# Altium schematic sheet Programmer.SchDoc: Programmer
size A3; Organization: Use Organization_Name in ProjParam; Address1: Eliot Ferragni; Address2: STI-MOBOTS; Address3: EPFL; Address4: CH-1015 LAUSANNE; DocumentNumber: 9; Revision: A; SheetNumber: 3; SheetTotal: 11; ApprovedBy: Init ApprovedBy in DocParam; CheckedBy: Init CheckedBy in DocParam; Author: Init Author in DocParam; CompanyName: Init CompanyName in DocParam; DrawnBy: Init DrawBy in DocParam; Engineer: Init Engineer in DocParam; Title2: BlackMagic prog + 4 BLDC controller + pwr ctrl; DocumentName: Init DocumentName in DocParam; ProjectName: Init ProjectName in DocParam
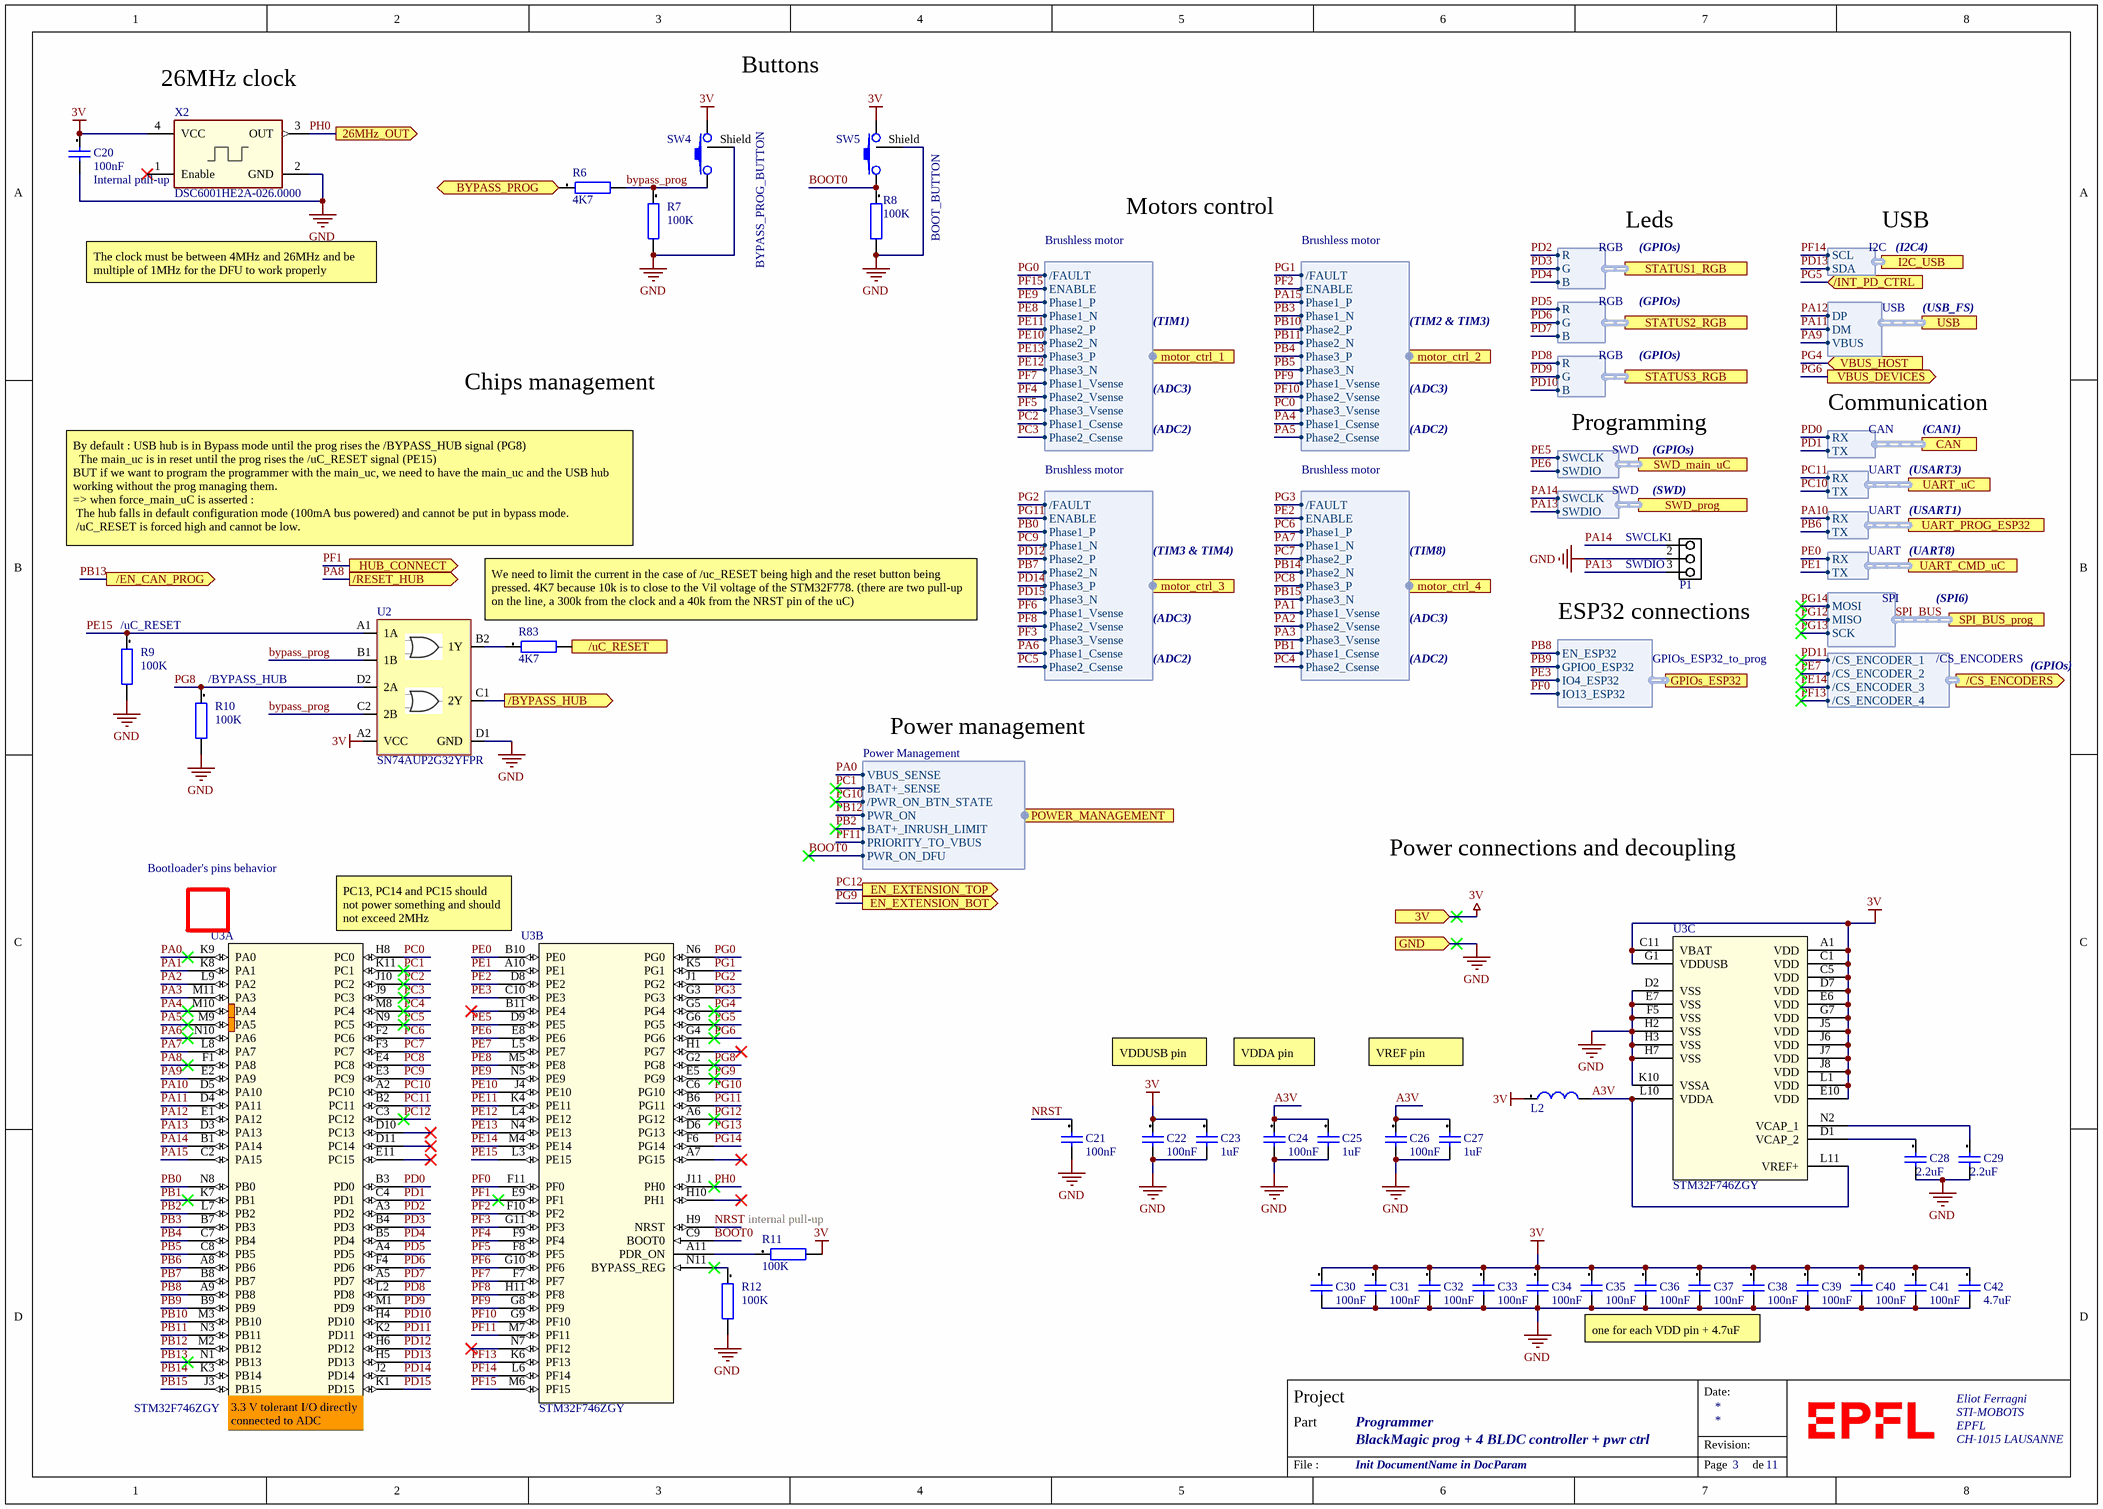
[diagram p0: Programmer.SchDoc]

## Parts
C20  100nF  [CAPC0201(0603)33_L]
C21  100nF  [CAPC0201(0603)33_L]
C22  100nF  [CAPC0201(0603)33_L]
C23  1uF  [CAPC0201(0603)33_L]
C24  100nF  [CAPC0201(0603)33_L]
C25  1uF  [CAPC0201(0603)33_L]
C26  100nF  [CAPC0201(0603)33_L]
C27  1uF  [CAPC0201(0603)33_L]
C28  2.2uF  [CAPC0201(0603)33_L]
C29  2.2uF  [CAPC0201(0603)33_L]
C30  100nF  [CAPC0201(0603)33_L]
C31  100nF  [CAPC0201(0603)33_L]
C32  100nF  [CAPC0201(0603)33_L]
C33  100nF  [CAPC0201(0603)33_L]
C34  100nF  [CAPC0201(0603)33_L]
C35  100nF  [CAPC0201(0603)33_L]
C36  100nF  [CAPC0201(0603)33_L]
C37  100nF  [CAPC0201(0603)33_L]
C38  100nF  [CAPC0201(0603)33_L]
C39  100nF  [CAPC0201(0603)33_L]
C40  100nF  [CAPC0201(0603)33_L]
C41  100nF  [CAPC0201(0603)33_L]
C42  4.7uF  [CAPC0201(0603)33_L]
L2  MMZ1005S601HT000  [0402 inductor]  (value not drawn)
P1  SWD_PADS_3pin  [SWD_pads_3pin]  (value not drawn)  (no BOM)
R6  4K7  [RESC0201(0603)_L]
R7  100K  [RESC0201(0603)_L]
R8  100K  [RESC0201(0603)_L]
R9  100K  [RESC0201(0603)_L]
R10  100K  [RESC0201(0603)_L]
R11  100K  [RESC0201(0603)_L]
R12  100K  [RESC0201(0603)_L]
R83  4K7  [RESC0201(0603)_L]
SW4  button  [C&K_KMR2]  (value not drawn)
SW5  button  [C&K_KMR2]  (value not drawn)
U2  SN74AUP2G32YFPR  [DSBGA 8-pin Ti]
U3  STM32F746ZGY  [WLCSP-143]  (parts A,B,C of 3)
X2  DSC6001HE2A-026.0000  [Oscillator 1.6x1.2mm VFLGA]

## Ports
3V (in), 26MHz_OUT (out), /BYPASS_HUB (out), /CS_ENCODERS (out, harness /CS_ENCODERS), /EN_CAN_PROG (out), /INT_PD_CTRL (in), /RESET_HUB (out), /uC_RESET (out), BYPASS_PROG (bidir), CAN (harness CAN), EN_EXTENSION_BOT (out), EN_EXTENSION_TOP (out), GND (in), GPIOs_ESP32 (harness GPIOs_ESP32_to_prog), HUB_CONNECT (out), I2C_USB (harness I2C), motor_ctrl_1 (harness Brushless motor), motor_ctrl_2 (harness Brushless motor), motor_ctrl_3 (harness Brushless motor), motor_ctrl_4 (harness Brushless motor), POWER_MANAGEMENT (harness Power Management), SPI_BUS_prog (harness SPI), STATUS1_RGB (harness RGB), STATUS2_RGB (harness RGB), STATUS3_RGB (harness RGB), SWD_main_uC (harness SWD), SWD_prog (harness SWD), UART_CMD_uC (harness UART), UART_PROG_ESP32 (harness UART), UART_uC (harness UART), USB (harness USB), VBUS_DEVICES (out), VBUS_HOST (in)

## Harnesses
CAN: TX, RX
USB: DM, DP, VBUS
UART: RX, TX
SWD: SWDIO, SWCLK
RGB: R, G, B
I2C: SDA, SCL
SPI: MISO, MOSI, SCK
Power Management: VBUS_SENSE, BAT+_SENSE, /PWR_ON_BTN_STATE, PWR_ON, BAT+_INRUSH_LIMIT, PRIORITY_TO_VBUS, PWR_ON_DFU
/CS_ENCODERS: /CS_ENCODER_1, /CS_ENCODER_2, /CS_ENCODER_3, /CS_ENCODER_4
Brushless motor: Phase1_P, Phase1_N, Phase2_P, Phase2_N, Phase3_P, Phase3_N, Phase1_Vsense, Phase2_Vsense, Phase3_Vsense, Phase1_Csense, ENABLE, /FAULT, Phase2_Csense
GPIOs_ESP32_to_prog: IO4_ESP32, IO13_ESP32, GPIO0_ESP32, EN_ESP32

## Nets
3V: C20.1 C22.1 C23.1 C30.1 C31.1 C32.1 C33.1 C34.1 C35.1 C36.1 C37.1 C38.1 C39.1 C40.1 C41.1 C42.1 L2.1 R11.2 SW4.2 SW5.2 U2.A2(VCC) U3.A1(VDD) U3.C1(VDD) U3.C5(VDD) U3.C11(VBAT) U3.D7(VDD) U3.E6(VDD) U3.E10(VDD) U3.G1(VDDUSB) U3.G7(VDD) U3.J5(VDD) U3.J6(VDD) U3.J7(VDD) U3.J8(VDD) U3.L1(VDD) X2.4(VCC) ; port 3V
GND: C20.2 C21.2 C22.2 C23.2 C24.2 C25.2 C26.2 C27.2 C28.2 C29.2 C30.2 C31.2 C32.2 C33.2 C34.2 C35.2 C36.2 C37.2 C38.2 C39.2 C40.2 C41.2 C42.2 P1.2 R7.2 R8.2 R9.2 R10.2 R12.2 SW4.Shield SW5.Shield U2.D1(GND) U3.D2(VSS) U3.E7(VSS) U3.F5(VSS) U3.H2(VSS) U3.H3(VSS) U3.H7(VSS) U3.K10(VSSA) X2.2(GND) ; port GND
/BYPASS_HUB: U2.C1(2Y) ; port /BYPASS_HUB
/uC_RESET: R83.2 ; port /uC_RESET
A3V: C24.1 C25.1 C26.1 C27.1 L2.2 U3.L10(VDDA) U3.L11(VREF+)
BOOT0: R8.1 SW5.1 U3.C9(BOOT0) ; port POWER_MANAGEMENT.PWR_ON_DFU
bypass_prog: R6.2 R7.1 SW4.1 U2.B1(1B) U2.C2(2B)
BYPASS_PROG: R6.1 ; port BYPASS_PROG  [a separate net that carries the same name]
NRST: C21.1 U3.H9(NRST)
PA0: U3.K9(PA0) ; port POWER_MANAGEMENT.VBUS_SENSE
PA1: U3.K8(PA1) ; port motor_ctrl_4.Phase1_Vsense
PA2: U3.L9(PA2) ; port motor_ctrl_4.Phase2_Vsense
PA3: U3.M11(PA3) ; port motor_ctrl_4.Phase3_Vsense
PA4: U3.M10(PA4) ; port motor_ctrl_2.Phase1_Csense
PA5: U3.M9(PA5) ; port motor_ctrl_2.Phase2_Csense
PA6: U3.N10(PA6) ; port motor_ctrl_3.Phase1_Csense
PA7: U3.L8(PA7) ; port motor_ctrl_4.Phase1_N
PA8: U3.F1(PA8) ; port /RESET_HUB
PA9: U3.E2(PA9) ; port USB.VBUS
PA10: U3.D5(PA10) ; port UART_PROG_ESP32.RX
PA11: U3.D4(PA11) ; port USB.DM
PA12: U3.E1(PA12) ; port USB.DP
PA13: P1.3 U3.D3(PA13) ; port SWD_prog.SWDIO
PA14: P1.1 U3.B1(PA14) ; port SWD_prog.SWCLK
PA15: U3.C2(PA15) ; port motor_ctrl_2.Phase1_P
PB0: U3.N8(PB0) ; port motor_ctrl_3.Phase1_P
PB1: U3.K7(PB1) ; port motor_ctrl_4.Phase1_Csense
PB2: U3.L7(PB2) ; port POWER_MANAGEMENT.BAT+_INRUSH_LIMIT
PB3: U3.B7(PB3) ; port motor_ctrl_2.Phase1_N
PB4: U3.C7(PB4) ; port motor_ctrl_2.Phase3_P
PB5: U3.C8(PB5) ; port motor_ctrl_2.Phase3_N
PB6: U3.A8(PB6) ; port UART_PROG_ESP32.TX
PB7: U3.B8(PB7) ; port motor_ctrl_3.Phase2_N
PB8: U3.A9(PB8) ; port GPIOs_ESP32.EN_ESP32
PB9: U3.B9(PB9) ; port GPIOs_ESP32.GPIO0_ESP32
PB10: U3.M3(PB10) ; port motor_ctrl_2.Phase2_P
PB11: U3.N3(PB11) ; port motor_ctrl_2.Phase2_N
PB12: U3.M2(PB12) ; port POWER_MANAGEMENT.PWR_ON
PB13: U3.N1(PB13) ; port /EN_CAN_PROG
PB14: U3.K3(PB14) ; port motor_ctrl_4.Phase2_N
PB15: U3.J3(PB15) ; port motor_ctrl_4.Phase3_N
PC0: U3.H8(PC0) ; port motor_ctrl_2.Phase3_Vsense
PC1: U3.K11(PC1) ; port POWER_MANAGEMENT.BAT+_SENSE
PC2: U3.J10(PC2) ; port motor_ctrl_1.Phase1_Csense
PC3: U3.J9(PC3) ; port motor_ctrl_1.Phase2_Csense
PC4: U3.M8(PC4) ; port motor_ctrl_4.Phase2_Csense
PC5: U3.N9(PC5) ; port motor_ctrl_3.Phase2_Csense
PC6: U3.F2(PC6) ; port motor_ctrl_4.Phase1_P
PC7: U3.F3(PC7) ; port motor_ctrl_4.Phase2_P
PC8: U3.E4(PC8) ; port motor_ctrl_4.Phase3_P
PC9: U3.E3(PC9) ; port motor_ctrl_3.Phase1_N
PC10: U3.A2(PC10) ; port UART_uC.TX
PC11: U3.B2(PC11) ; port UART_uC.RX
PC12: U3.C3(PC12) ; port EN_EXTENSION_TOP
PD0: U3.B3(PD0) ; port CAN.RX
PD1: U3.C4(PD1) ; port CAN.TX
PD2: U3.A3(PD2) ; port STATUS1_RGB.R
PD3: U3.B4(PD3) ; port STATUS1_RGB.G
PD4: U3.B5(PD4) ; port STATUS1_RGB.B
PD5: U3.A4(PD5) ; port STATUS2_RGB.R
PD6: U3.F4(PD6) ; port STATUS2_RGB.G
PD7: U3.A5(PD7) ; port STATUS2_RGB.B
PD8: U3.L2(PD8) ; port STATUS3_RGB.R
PD9: U3.M1(PD9) ; port STATUS3_RGB.G
PD10: U3.H4(PD10) ; port STATUS3_RGB.B
PD11: U3.K2(PD11) ; port /CS_ENCODERS./CS_ENCODER_1
PD12: U3.H6(PD12) ; port motor_ctrl_3.Phase2_P
PD13: U3.H5(PD13) ; port I2C_USB.SDA
PD14: U3.J2(PD14) ; port motor_ctrl_3.Phase3_P
PD15: U3.K1(PD15) ; port motor_ctrl_3.Phase3_N
PE0: U3.B10(PE0) ; port UART_CMD_uC.RX
PE1: U3.A10(PE1) ; port UART_CMD_uC.TX
PE2: U3.D8(PE2) ; port motor_ctrl_4.ENABLE
PE3: U3.C10(PE3) ; port GPIOs_ESP32.IO4_ESP32
PE5: U3.D9(PE5) ; port SWD_main_uC.SWCLK
PE6: U3.E8(PE6) ; port SWD_main_uC.SWDIO
PE7: U3.L5(PE7) ; port /CS_ENCODERS./CS_ENCODER_2
PE8: U3.M5(PE8) ; port motor_ctrl_1.Phase1_N
PE9: U3.N5(PE9) ; port motor_ctrl_1.Phase1_P
PE10: U3.J4(PE10) ; port motor_ctrl_1.Phase2_N
PE11: U3.K4(PE11) ; port motor_ctrl_1.Phase2_P
PE12: U3.L4(PE12) ; port motor_ctrl_1.Phase3_N
PE13: U3.N4(PE13) ; port motor_ctrl_1.Phase3_P
PE14: U3.M4(PE14) ; port /CS_ENCODERS./CS_ENCODER_3
PE15: R9.1 U2.A1(1A) U3.L3(PE15)
PF0: U3.F11(PF0) ; port GPIOs_ESP32.IO13_ESP32
PF1: U3.E9(PF1) ; port HUB_CONNECT
PF2: U3.F10(PF2) ; port motor_ctrl_2.ENABLE
PF3: U3.G11(PF3) ; port motor_ctrl_3.Phase3_Vsense
PF4: U3.F9(PF4) ; port motor_ctrl_1.Phase2_Vsense
PF5: U3.F8(PF5) ; port motor_ctrl_1.Phase3_Vsense
PF6: U3.G10(PF6) ; port motor_ctrl_3.Phase1_Vsense
PF7: U3.F7(PF7) ; port motor_ctrl_1.Phase1_Vsense
PF8: U3.H11(PF8) ; port motor_ctrl_3.Phase2_Vsense
PF9: U3.G8(PF9) ; port motor_ctrl_2.Phase1_Vsense
PF10: U3.G9(PF10) ; port motor_ctrl_2.Phase2_Vsense
PF11: U3.M7(PF11) ; port POWER_MANAGEMENT.PRIORITY_TO_VBUS
PF13: U3.K6(PF13) ; port /CS_ENCODERS./CS_ENCODER_4
PF14: U3.L6(PF14) ; port I2C_USB.SCL
PF15: U3.M6(PF15) ; port motor_ctrl_1.ENABLE
PG0: U3.N6(PG0) ; port motor_ctrl_1./FAULT
PG1: U3.K5(PG1) ; port motor_ctrl_2./FAULT
PG2: U3.J1(PG2) ; port motor_ctrl_3./FAULT
PG3: U3.G3(PG3) ; port motor_ctrl_4./FAULT
PG4: U3.G5(PG4) ; port VBUS_HOST
PG5: U3.G6(PG5) ; port /INT_PD_CTRL
PG6: U3.G4(PG6) ; port VBUS_DEVICES
PG8: R10.1 U2.D2(2A) U3.G2(PG8)
PG9: U3.E5(PG9) ; port EN_EXTENSION_BOT
PG10: U3.C6(PG10) ; port POWER_MANAGEMENT./PWR_ON_BTN_STATE
PG11: U3.B6(PG11) ; port motor_ctrl_3.ENABLE
PG12: U3.A6(PG12) ; port SPI_BUS_prog.MISO
PG13: U3.D6(PG13) ; port SPI_BUS_prog.SCK
PG14: U3.F6(PG14) ; port SPI_BUS_prog.MOSI
PH0: U3.J11(PH0) X2.3(OUT) ; port 26MHz_OUT
NetC28_1: C28.1 U3.D1(VCAP_2)
NetC29_1: C29.1 U3.N2(VCAP_1)
NetR11_1: R11.1 U3.A11(PDR_ON)
NetR12_1: R12.1 U3.N11(BYPASS_REG)
NetR83_1: R83.1 U2.B2(1Y)

Not connected (* = marked no-connect by the designer): U3 A7(PG15)* B11(PE4)* D10(PC13)* D11(PC14)* E11(PC15)* H1(PG7)* H10(PH1)* N7(PF12)*; X2 1(Enable)*

## Buses and harness runs
harness SPI_BUS = port SPI_BUS_prog

## Notes on the sheet
- (near X2) 26MHz clock
- Buttons
- (near X2) Internal pull-up
- BOOT_BUTTON
- Motors control
- Leds
- USB
- The clock must be between 4MHz and 26MHz and be multiple of 1MHz for the DFU to work properly
- (near SW4) BYPASS_PROG_BUTTON
- (GPIOs)
- (I2C4)
- (USB_FS)
- (TIM1)
- (TIM2 & TIM3)
- Chips management
- (ADC2)
- (ADC3)
- Programming
- Communication
- (CAN1)
- (near P1) (SWD)
- (USART1)
- (USART3)
- By default : USB hub is in Bypass mode until the prog rises the /BYPASS_HUB signal (PG8)
  The main_uc is in reset until the prog rises the /uC_RESET signal (PE15)
  BUT if we want to program the programmer with the main_uc, we need to have the main_uc and the USB hub working without the prog managing them.
  => when force_main_uC is asserted :
  The hub falls in default configuration mode (100mA bus powered) and cannot be put in bypass mode.
  /uC_RESET is forced high and cannot be low.
- (TIM3 & TIM4)
- (TIM8)
- (near P1) SWCLK
- (near P1) SWDIO
- (UART8)
- (near R9) /uC_RESET
- We need to limit the current in the case of /uc_RESET being high and the reset button being pressed. 4K7 because 10k is to close to the Vil voltage of the STM32F778. (there are two pull-up on the line, a 300k from the clock and a 40k from the NRST pin of the uC)
- (near P1) ESP32 connections
- (SPI6)
- (near R10) /BYPASS_HUB
- Power management
- (ADC1)
- Power connections and decoupling
- Bootloader's pins behavior
- (near U3) PC13, PC14 and PC15 should not power something and should not exceed 2MHz
- VDDUSB pin
- VDDA pin
- VREF pin
- (near R11) internal pull-up
- one for each VDD pin + 4.7uF
- Bootloader's pins behavior :
  USART1 :
  PA10 (RX) set as input 		-> connected to RX UART_PROG_ESP32					=> OK
  PA9 (TX) set as output high		-> connected to VBUS_DEVICES					=> problem if VBUS_DEVICES is low -> Serial Resistance
  USART3:
  PB11 (RX) set as input		-> connected to Phase2_N motor2 with pull-down				=> OK
  PB10 (TX) set as output high		-> connected to Phase2_P motor2 with pull-down				=> not really a problem because all other transistors of this motor are OFF
  PC11 (RX) set as input		-> connected to RX UART_uC						=> OK
  PC10 (TX) set as output high		-> connected to TX UART_uC						=> OK
  CAN2 (slave):
  PB5 (RX) set as input			-> connected to Phase3_N motor2 with pull-down				=> OK
  PB13 (TX) set as output high		-> connected to /EN_CAN_PROG with internal pull-down			=> Disables the CAN transceiver => OK
  I2C1 (slave):
  PB6 (SCL) set as open-drain		-> connected to TX UART_PROG_ESP32					=> OK
  PB9 (SDA) set as open-drain		-> connected to GPIO0_ESP32 						=> OK
  I2C2 (slave):
  PF1 (SCL) set as open-drain		-> connected to HUB_CONNECT with pull-up/pull-down			=> OK
  PF0 (SDA) set as open-drain		-> connected to GPIO12_ESP32 						=> OK
  I2C3 (slave):
  PA8 (SCL) set as open-drain		-> connected to /RESET_HUB with pull-up					=> OK
  PC9 (SDA) set as open-drain		-> connected to Phase1_N motor3 with pull-down				=> OK
  SPI1 (slave):
  PA7 (MOSI) set as input pull-down	-> connected to Phase1_N motor4 with pull-down				=> OK
  PA6 (MISO) set as output pull-down	-> connected to Phase 1_Csense motor3					=> OK because the DRV8323 is OFF while in bootloader mode
  PA5 (SCK) set as input pull-down	-> connected to Phase 2_Csense motor2					=> OK because the DRV8323 is OFF while in bootloader mode
  PA4 (NSS) set as input pull-up		-> connected to Phase 1_Csense motor2					=> OK because the DRV8323 is OFF while in bootloader mode
  SPI2 (slave):
  PI3 (MOSI) set as input pull-down	-> not for WLCSP package 						=> OK
  PI2 (MISO) set as output pull-down	-> not for WLCSP package 						=> OK
  PI1 (SCK) set as input pull-down		-> not for WLCSP package 						=> OK
  PI0 (NSS) set as input pull-up		-> not for WLCSP package 						=> OK
  SPI4 (slave):
  PE14 (MOSI) set as input pull-down	-> connected to /CS_ENCODER_3					=> OK
  PE13 (MISO) set as output pull-down	-> connected to Phase3_P motor1 with pull-down				=> OK
  PE12 (SCK) set as input pull-down	-> connected to Phase3_N motor1 with pull-down				=> OK
  PE11 (NSS) set as input pull-up		-> connected to Phase2_P motor1 with pull-down				=> not really a problem because all other transistors of this motor are OFF
  USB (DFU):
  PA11 (DM)			-> connected to DM of the USB Hub					=> OK
  PA12 (DP) (no pull-up needed)		-> connected to DP of the USB hub					=> OK
- Date:
- Project
- Part
- Revision:
- File :
- Page
- de
- (in symbol STM32F74XZXY, part A) 3.3 V tolerant I/O directly connected to ADC

## Library data of the parts
C20-C42 = TBD Capacitor[[/\]]0201[[/\]]1: Capacitor 0201; Preference: 1; Currentie: CHF; Type: SMD; Note: To buy by assembler; Size: 0201; Footprint Acort: 0201; ROHS: True; DateLastUpdate: 2018-10-19 / 8:59:52 AM; Manufacturer: -; Manufacturer part number: -; Package / Case: Capacitor 0201
L2 = MMZ1005S601HT000: FERRITE BEAD 600 OHM 0402 1LN; Manufacturer: TDK; Type: SMD; Note: To buy by assembler; Supplier 1: Digi-Key; Stock 1: 33440; Pricing 1: 1 = 0,10000, 10 = 0,07300, 25 = 0,06600, 50 = 0,05940, 100 = 0,04360, 250 = 0,03168, 500 = 0,02904, 1000 = 0,02508, 5000 = 0,01980 (USD); RoHS: No; ComponentLink1URL: https://product.tdk.com/info/en/catalog/datasheets/beads_commercial_signal_mmz1005-h_en.pdf?src-supplier=Digi-Key; ComponentLink1Description: https://product.tdk.com/info/en/catalog/datasheets/beads_commercial_signal_mmz1005-h_en.pdf?src-supplier=Digi-Key; Supplier Part Number 1: 445-175172-1-ND; Manufacturer Part Number: MMZ1005S601HT000; Package / Case: Ferrite bead 0402
R6-R12 R83 = TBD[[/\]]0201[[/\]]1: Resistor 0201; Preference: 1; Currentie: CHF; Note: To buy by assembler; Size: 0201; Footprint Acort: 0201; ROHS: True; DateLastUpdate: 2018-10-19 / 9:06:49 AM; Type: SMD; Manufacturer: -; Manufacturer part number: -; Package / Case: Resistor 0201
SW4 SW5 = C&K KMR2: KMR221GLFS; Manufacturer: C&K; Manufacturer Nr: 7-188275-6; Preference: 1; Currentie: CHF; Quant_1: 10; Quant_2: 900; Circuit: SPST-NO; Switch Function: Off-Mom; Contact Rating @ Voltage: 0.05A @ 32VDC; Actuator Type: Standard; Actuator Height off PCB, from Pins: 1.90mm; Actuator Orientation: Top Actuated; Outline: 4.60mm x 2.80mm; Illumination: Non-Illuminated; Operating Force: 200gf; Switch Travel: 0.25mm; Mechanical Life: 200,000 Cycles; Note: To buy by assembler; Footprint Acort: ToDefine; ComponentLink1Description: Datasheet; ComponentLink1URL: http://ecommas.tycoelectronics.com/commerce/DocumentDelivery/DDEController?Action=showdoc&DocId=Customer+Drawing%7F188275%7FR%7Fpdf%7FEnglish%7FC_188275_R.pdf; Supplier: Farnell; Supplier Nr: 1056234; ComponentLink2Description: Farnell link; ComponentLink2URL: http://fr.farnell.com/jsp/displayProduct.jsp?sku=1056234; ROHS: True; Type: SMD; Orientation: Vertical; DateLastUpdate: 2007-12-04 / 09:15:57; Price_1: 1,1; Price_2: 0,924; Supplier 1: Digi-Key; Manufacturer Part Number: KMR221GLFS; Category: Switches; Stock 1: 20549; Pricing 1: 1=0.51, 10=0.493, 25=0.484, 50=0.4656, 100=0.4017, 250=0.3652, 500=0.34694, 1000=0.2739 (USD); Packaging: Cut Tape (CT); Mounting Type: Surface Mount; Termination Style: Gull Wing; Illumination Voltage (Nominal): -; Illumination Type, Color: -; Ingress Protection: -; Features: Grounding Pin; Actuator Material: -; Operating Temperature: -40°C ~ 85°C; ComponentLink3URL: http://www.ck-components.com/index.php?module=media&action=Display&cmpref=14414&lang=en&width=&height=&format=&alt=; ComponentLink3Description: http://www.ck-components.com/index.php?module=media&action=Display&cmpref=14414&lang=en&width=&height=&format=&alt=; Supplier Part Number 1: 401-1427-1-ND; Package / Case: SMD Button
U2 = SN74AUP2G32YFPR: IC GATE OR 2CH 2-INP 8DSBGA; Manufacturer: Texas Instruments; Output Current: 20mA; Output Voltage: 3.6V; Number of Inputs: 2; Propagation Delay: 6.2ns; Min Supply Voltage: 800mV; Number of Outputs: 1; Low Level Output Current: 4mA; Quiescent Current: 500nA; High Level Output Current: -4mA; Note: To buy by assembler; Supplier 1: Digi-Key; Stock 1: 2550; Pricing 1: 1 = 0,64000, 10 = 0,56100, 100 = 0,43000, 500 = 0,33990, 1000 = 0,27192 (USD); RoHS: Yes; Mount: Surface Mount; Number of Pins: 8; Min Operating Temperature: -40°C; Max Operating Temperature: 85°C; Package Quantity: 1; Packaging: Tape and Reel; Logic Function: OR; Max Supply Voltage: 3.6V; Number of Gates: 2; Number of Input Lines: 2; Number of Output Lines: 2; Number of Circuits: 2; Number of Elements: 2; Number of Bits: 2; Radiation Hardening: No; Lead Free: Lead Free; ComponentLink1URL: https://datasheet.ciiva.com/4219/4951sn74aup2g32-4219026.pdf?src-supplier=Arrow; ComponentLink1Description: https://datasheet.ciiva.com/4219/4951sn74aup2g32-4219026.pdf?src-supplier=Arrow; ComponentLink2URL: https://datasheet.ciiva.com/1867/sn74aup2g32-1867078.pdf?src-supplier=Digi-Key; ComponentLink2Description: https://datasheet.ciiva.com/1867/sn74aup2g32-1867078.pdf?src-supplier=Digi-Key; ComponentLink3URL: https://datasheet.ciiva.com/1867/sn74aup2g32-1867079.pdf?src-supplier=Digi-Key; ComponentLink3Description: https://datasheet.ciiva.com/1867/sn74aup2g32-1867079.pdf?src-supplier=Digi-Key; ComponentLink4URL: https://datasheet.ciiva.com/1867/sn74aup2g32-1867080.pdf?src-supplier=Digi-Key; ComponentLink4Description: https://datasheet.ciiva.com/1867/sn74aup2g32-1867080.pdf?src-supplier=Digi-Key; ComponentLink5URL: https://datasheet.ciiva.com/14309/sn74aup2g32-14309790.pdf?src-supplier=Avnet; ComponentLink5Description: https://datasheet.ciiva.com/14309/sn74aup2g32-14309790.pdf?src-supplier=Avnet; Supplier Part Number 1: 296-25209-1-ND; Manufacturer Part Number: SN74AUP2G32YFPR; Type: SMD; Package / Case: DSBGA-8
U3 = STM32F74XZXY: High Performance 32bits microcontroler; Vendor: STMicroelectronics; C: Copyright (C) 2016 Accelerated Designs. All rights reserved; Note: To buy by assembler; Manufacturer_Part_Number: stm32f746ZGY; Copyright: Copyright (C) 2016 Accelerated Designs. All rights reserved; RefDes: RefDes; Type: SMD; Value: Value; Manufacturer: STMicroelectronics; Manufacturer part number: STM32F746ZGY; Package / Case: WLCSP-143
X2 = DSC6001HE2A-026.0000: 26MHz LVCMOS MEMS (Silicon) Oscillator  1.71 V ~ 3.63 V Enable/Disable; Manufacturer: Microchip; Note: To buy by assembler; Supplier 1: Digi-Key; Stock 1: 797; Pricing 1: 1 = 1,07000, 25 = 0,89600, 100 = 0,81370 (USD); RoHS: No; Supplier Part Number 1: DSC6001HE2A-026.0000-ND; Manufacturer Part Number: DSC6001HE2A-026.0000; Type: SMD; Package / Case: VFLGA-4
P1 = SWD_PADS_3pin: Type: SMD